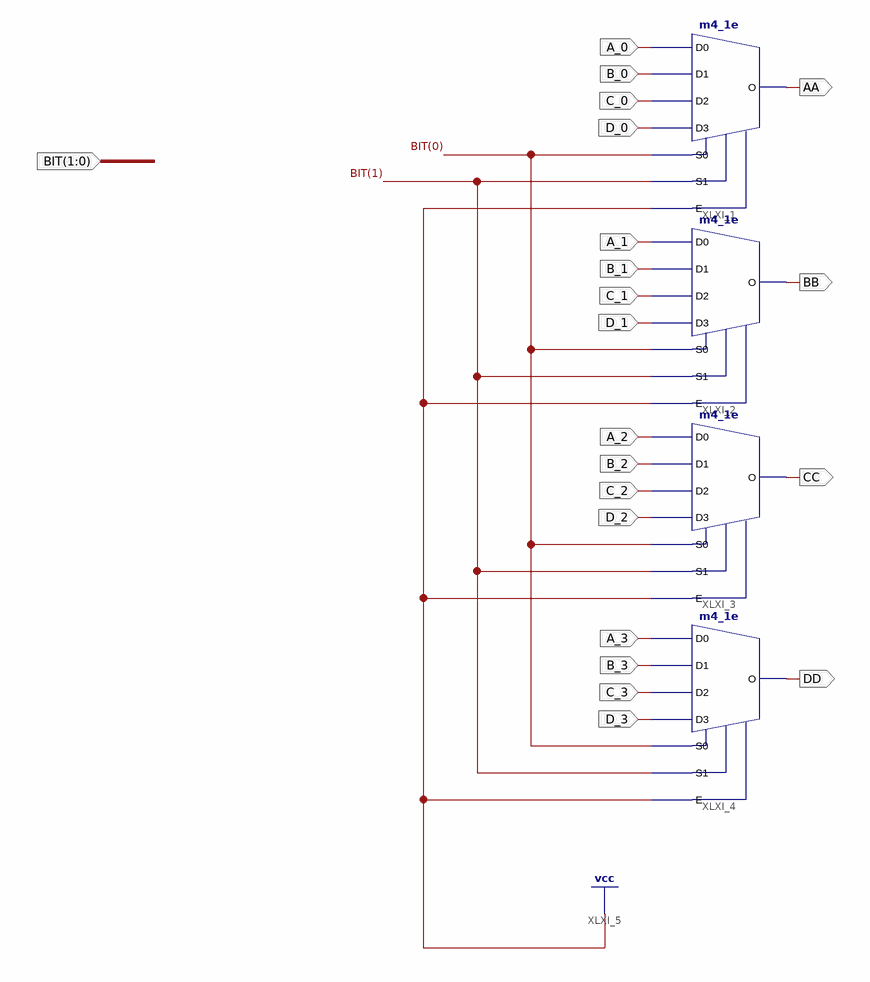
[diagram p0: schematic sheet 1]
// Xilinx ISE schematic Mux_4_1.sch (spartan6) as structural Verilog: 4 symbols, 21 ports
module Mux_4_1 (
  input  [1:0] BIT,
  input  A_0,
  input  A_1,
  input  A_2,
  input  A_3,
  input  B_0,
  input  C_0,
  input  D_0,
  input  B_1,
  input  C_1,
  input  D_1,
  input  B_2,
  input  C_2,
  input  D_2,
  input  B_3,
  input  C_3,
  input  D_3,
  output AA,
  output BB,
  output CC,
  output DD
);

  m4_1e XLXI_1 (.D0(A_0), .D1(B_0), .D2(C_0), .D3(D_0), .E(1'b1), .S0(BIT[0]), .S1(BIT[1]), .O(AA));
  m4_1e XLXI_2 (.D0(A_1), .D1(B_1), .D2(C_1), .D3(D_1), .E(1'b1), .S0(BIT[0]), .S1(BIT[1]), .O(BB));
  m4_1e XLXI_3 (.D0(A_2), .D1(B_2), .D2(C_2), .D3(D_2), .E(1'b1), .S0(BIT[0]), .S1(BIT[1]), .O(CC));
  m4_1e XLXI_4 (.D0(A_3), .D1(B_3), .D2(C_3), .D3(D_3), .E(1'b1), .S0(BIT[0]), .S1(BIT[1]), .O(DD));
endmodule
